# EasyEDA schematic 1-Schematic_Great Scott Li-Ion Battery Charger.json
TITLE: LiPo Charge/Protect/Boost; REV: 1.0; Date: 2017-07-31; Sheet: 1/1; Drawn By: GreatScott
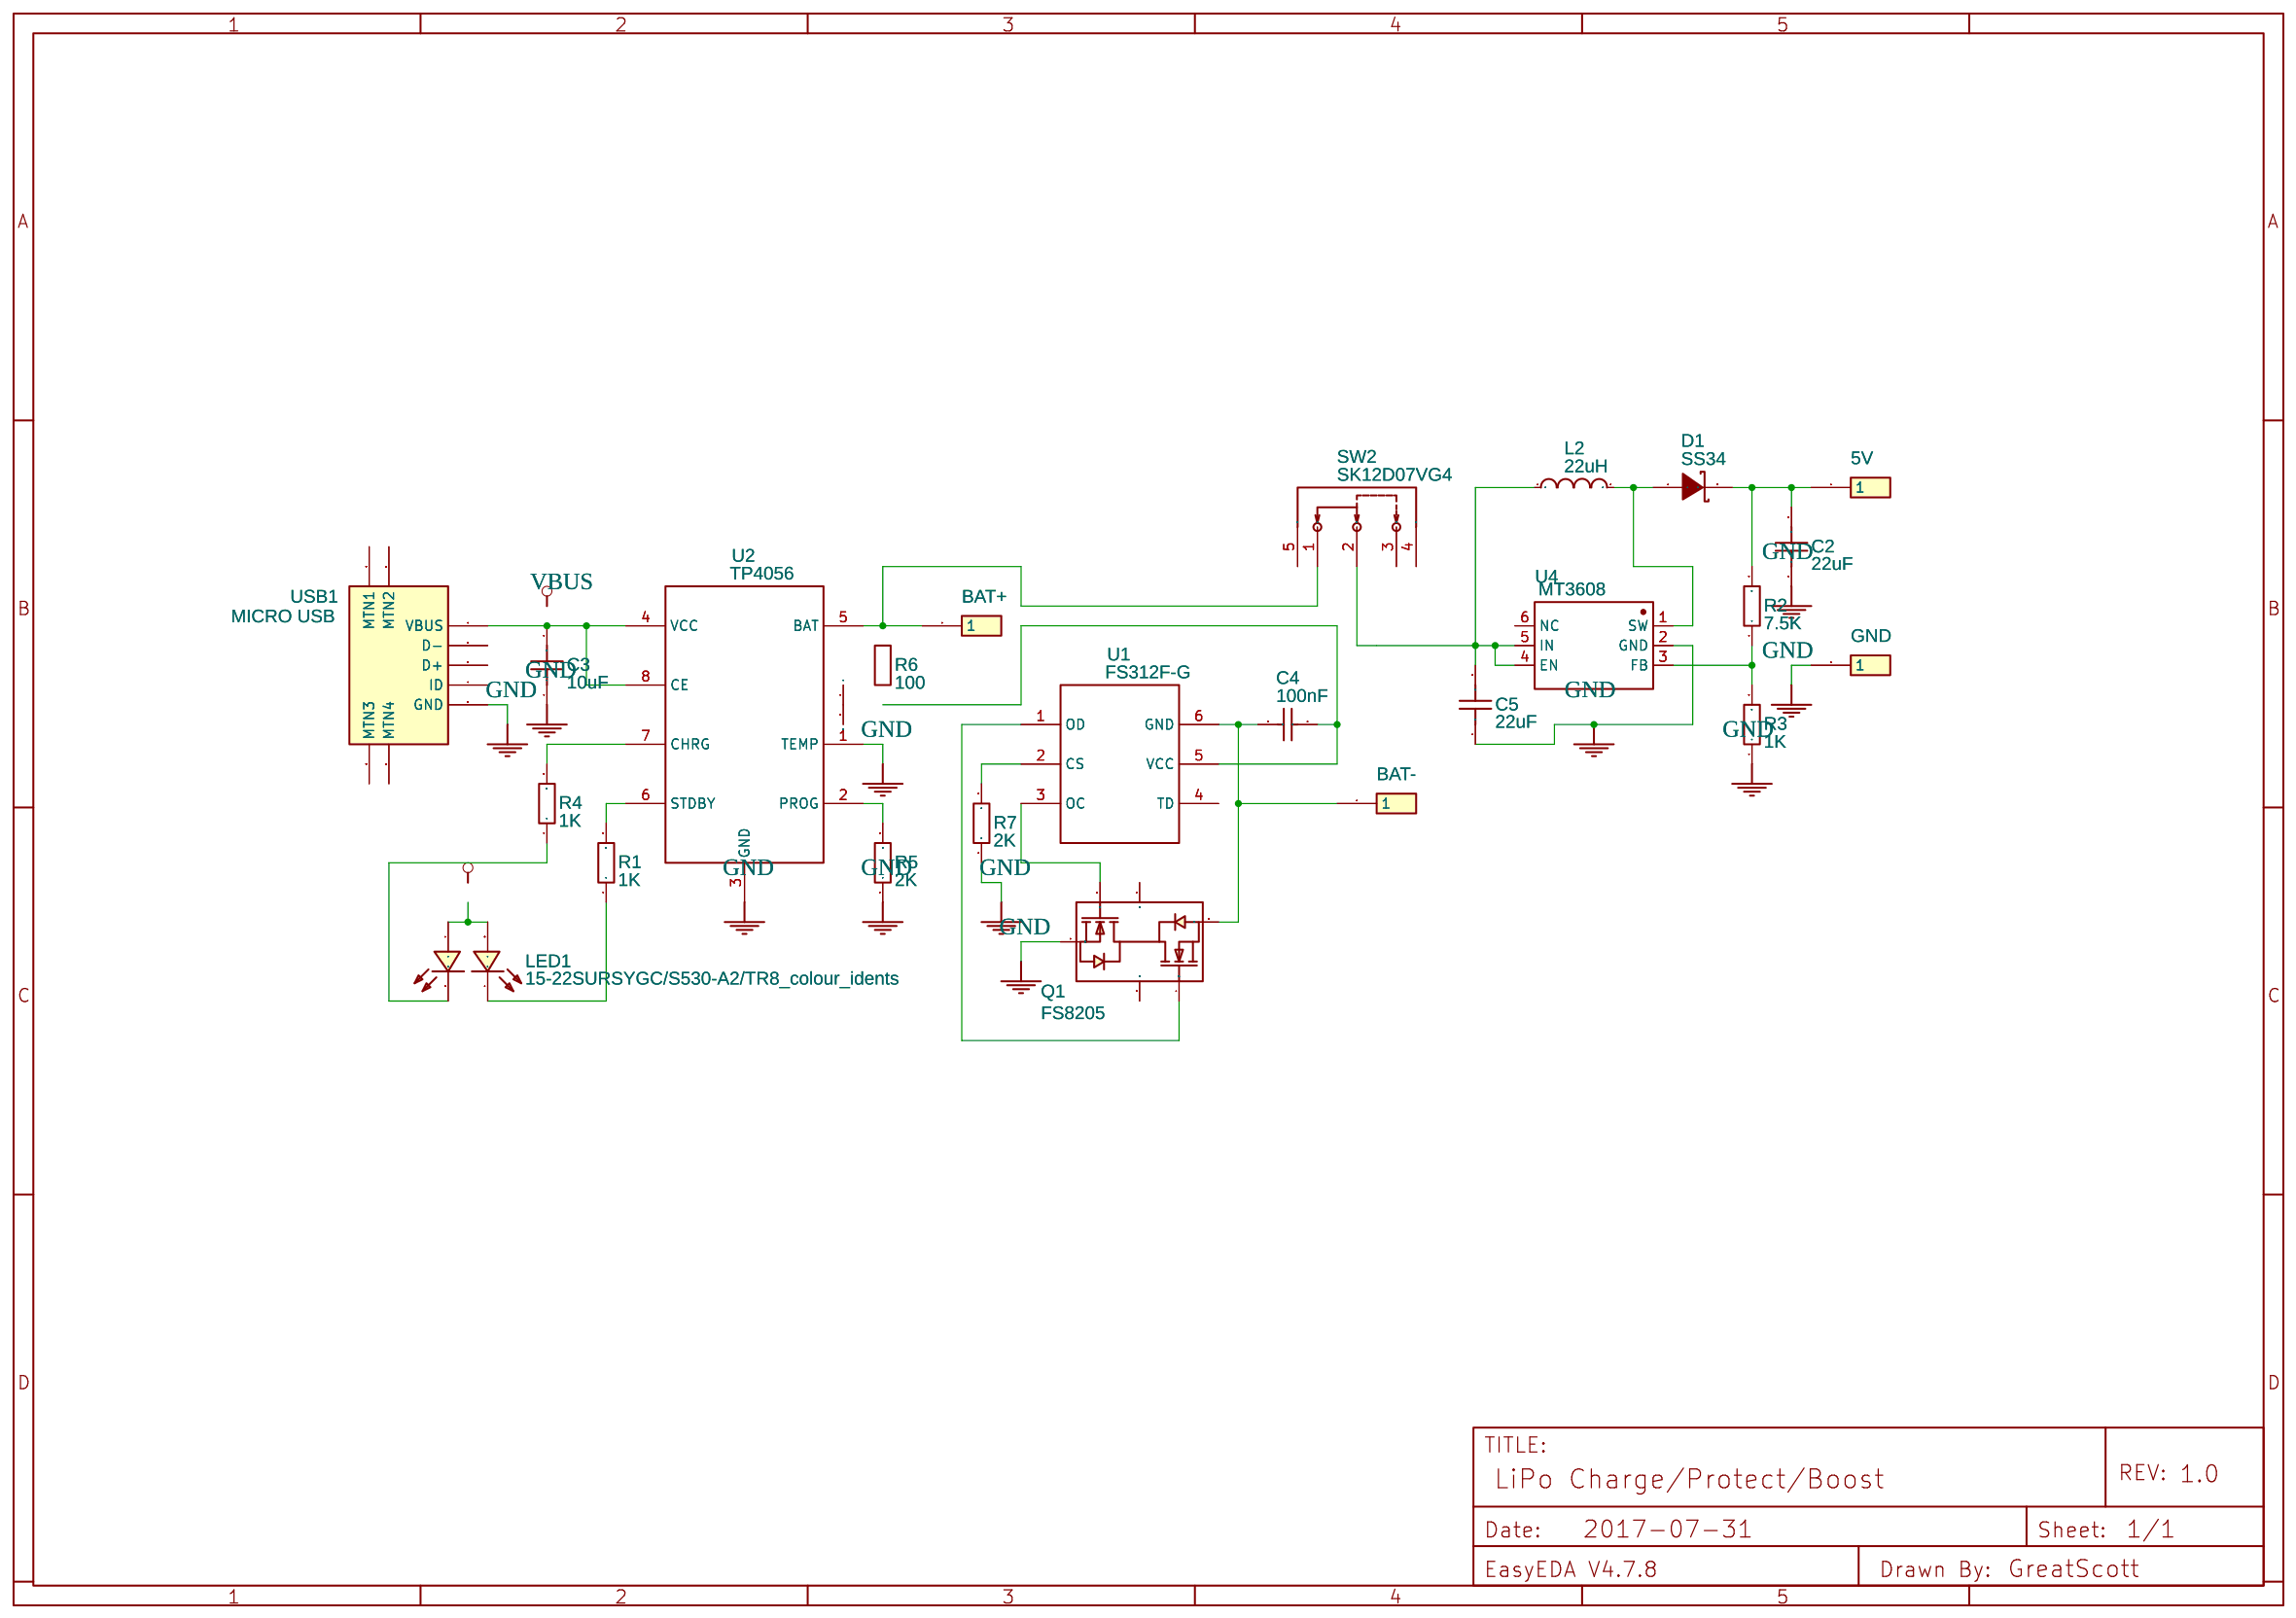
[diagram p0: schematic sheet]

## Parts
5V  5V  [HDR-1X1/2.54]
BAT+  BAT+  [HDR-1X1/2.54]
BAT-  BAT-  [HDR-1X1/2.54]
C2  22uF  [0603]
C3  10uF  [0603]
C4  100nF  [0402]
C5  22uF  [0603]
D1  SS34  [SMA(DO-214AC)]
GND  GND  [HDR-1X1/2.54]
L2  22uH  [0603]
LED1  15-22SURSYGC/S530-A2/TR8_colour_idents  [15-22_SMD_LED]
Q1  FS8205  [SOT-23-6]
R1  1K  [0603]
R2  7.5K  [0603]
R3  1K  [0603]
R4  1K  [0603]
R5  2K  [0603]
R6  100  [0603]
R7  2K  [0603]
SW2  SK12D07VG4  [SW-TH_3PIN_SK12D07VG4]
U1  FS312F-G  [SOT-23-6]
U2  TP4056  [SOP-8_EP_150MIL]
U4  MT3608  [SOT-23-6]
USB1  MICRO USB  [MICRO-USB-1]

## Library data of the parts
5V BAT+ BAT- GND = -: Supplier: LCSC; Manufacturer: LCSC; Manufacturer Part: Header-Male-2.54_1x1; Supplier Part: C81276
C2 C5 = CL10A226MQ8NRNC: Supplier: LCSC; Manufacturer: SAMSUNG; LCSC Assembly: Yes; Supplier Part: C59461; SMT Type: Basic
C3 = CL10A106MQ8NNNC: Supplier: LCSC; Manufacturer: SAMSUNG; Supplier Part: C1691
C4 = CL05B104KO5NNNC: Supplier: LCSC; Manufacturer: SAMSUNG; LCSC Assembly: Yes; Supplier Part: C1525; SMT Type: Basic
D1 = -: Supplier: LCSC; Supplier Part: C8678
L2 = CMI160808J220KT: Supplier: LCSC; Supplier Part: C361669; Manufacturer: Guangdong Fenghua Advanced Tech; Contributor: LCSC
LED1 = -: Supplier: LCSC; Manufacturer: EVERLIGHT; Manufacturer Part: 15-22SURSYGC/S530-A2/TR8; Contributor: LCSC; Supplier Part: C131251
Q1 = -: Supplier: LCSC; Manufacturer: FORTUNE; Supplier Part: C32254
R1 R3 R4 = CR0603JA0102G: Supplier: LCSC; Manufacturer: LIZ; Supplier Part: C101253
R2 = 0603WAJ0752T5E: Supplier: LCSC; Manufacturer: UniOhm; Supplier Part: C26006
R5 R7 = RS-03K202JT: Supplier: LCSC; Manufacturer: FH; Supplier Part: C72817
R6 = Resistor: Manufacturer Part: ?
SW2 = -: Supplier: LCSC; Supplier Part: C393937; Manufacturer: SHOU HAN; Contributor: LCSC
U1 = -: Supplier: LCSC; Manufacturer: FORTUNE; Manufacturer Part: DW01+G; Supplier Part: C14213
U2 = -: Contributor: Guest; Supplier: LCSC; Manufacturer: TOPPOWER; Supplier Part: C16581
U4 = -: Supplier: LCSC; Manufacturer: LCSC; Supplier Part: C84817
USB1 = -: Supplier: LCSC; Manufacturer: LCSC; Manufacturer Part: MICRO USB 5S B; Supplier Part: C10418

## Nets
GND: C2.1 C3.1 C5.1 GND.1 Q1.1(S1) R3.1 R5.1 R7.1 U2.1(TEMP) U2.3(GND) U4.2(GND) USB1.5(GND)
VBUS: C3.2 LED1.1(A) LED1.3(A) U2.4(VCC) U2.8(CE) USB1.1(VBUS)
Net-(5V-1): 5V.1 C2.2 D1.2(K) R2.2
Net-(BAT+-1): BAT+.1 R6.2 SW2.1 U2.5(BAT)
Net-(BAT--1): BAT-.1 C4.1 Q1.3(S2) U1.6(GND)
Net-(C4-2): C4.2 R6.1 U1.5(VCC)
Net-(C5-2): C5.2 L2.1 SW2.2 U4.4(EN) U4.5(IN)
Net-(D1-1): D1.1(A) L2.2 U4.1(SW)
Net-(LED1-2): LED1.2(K) R4.1
Net-(LED1-4): LED1.4(K) R1.1
Net-(Q1-4): Q1.4(G2) U1.1(OD)
Net-(Q1-6): Q1.6(G1) U1.3(OC)
Net-(R1-2): R1.2 U2.6(STDBY)
Net-(R2-1): R2.1 R3.2 U4.3(FB)
Net-(R4-2): R4.2 U2.7(CHRG)
Net-(R5-2): R5.2 U2.2(PROG)
Net-(R7-2): R7.2 U1.2(CS)

Not connected (* = marked no-connect by the designer): Q1 2(D12) 5(D12); SW2 3 4 5; U1 4(TD); U4 6(NC); USB1 0(MTN1) 2(D-) 3(D+) 4(ID)
